# Altium project QUTMS-CC-V00.PrjPcb (part 2 of 2)
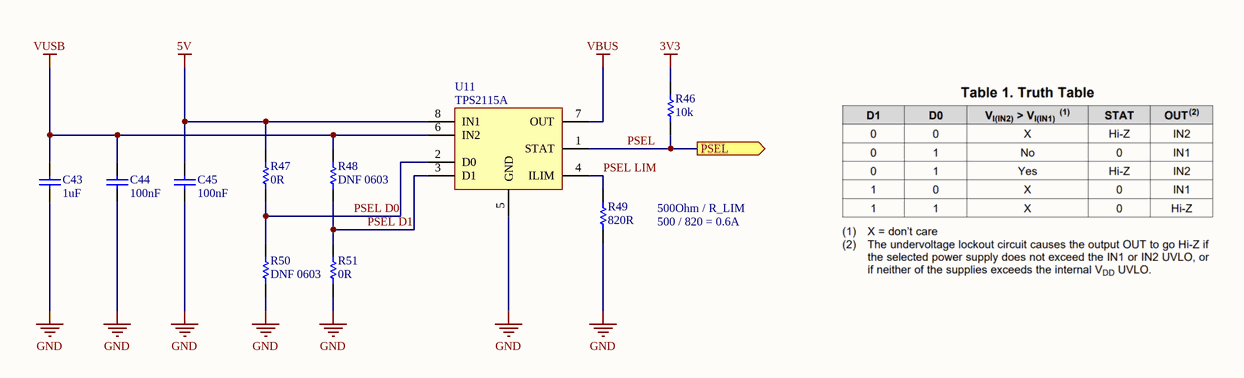
[diagram p13: CC-S12-V00-PowerSwitch.SchDoc]

## Nets that join several sheets
3V3: CANBUS 1 (C25A.2 DS1A.1 DS2A.1 U6A.3), CANBUS 2 (C25B.2 DS1B.1 DS2B.1 U6B.3), CANBUS 3 (C25C.2 DS1C.1 DS2C.1 U6C.3), CC-S08-V00-Connector (J4.B13 J4.B21), CC-S04-V00-SerialComs (C42.1 C51.1 U7.16 U8.1), CC-S01-V00-Microcontroller (23 pins), CC-S05-V00-MicrocontrollerPeripherals (C38.2 C39.2 C40.2 SD1.4), CC-S09-V00-PSU-3V3 (6 pins), CC-S12-V00-PowerSwitch (R46.2)
5V: CC-S08-V00-Connector (J4.B12 J4.B20), CC-S10-V00-PSU-5V (6 pins), CC-S12-V00-PowerSwitch (C45.2 R47.2 U11.8)
AGND: CC-S08-V00-Connector (J4.A5 J4.A20 J4.A21 J4.A22), Analog In1 (C26A.1 D9A.A D10A.A R25A.1), Analog In2 (C26B.1 D9B.A D10B.A R25B.1), Analog In3 (C26C.1 D9C.A D10C.A R25C.1), Analog In4 (C26D.1 D9D.A D10D.A R25D.1), Analog In5 (C26E.1 D9E.A D10E.A R25E.1), Analog In6 (C26F.1 D9F.A D10F.A R25F.1), Analog In7 (C26G.1 D9G.A D10G.A R25G.1), Analog In8 (C26H.1 D9H.A D10H.A R25H.1), Analog In9 (C26I.1 D9I.A D10I.A R25I.1), Analog In10 (C26J.1 D9J.A D10J.A R25J.1), Analog In11 (C26K.1 D9K.A D10K.A R25K.1), Analog In12 (C26L.1 D9L.A D10L.A R25L.1), CC-S11-V00-Power (L4.2 R44.2 R45.2)
GND: CANBUS 1 (C25A.1 D3A.3 U6A.2 U6A.8), CANBUS 2 (C25B.1 D3B.3 U6B.2 U6B.8), CANBUS 3 (C25C.1 D3C.3 U6C.2 U6C.8), CC-S08-V00-Connector (5 pins), CC-S04-V00-SerialComs (12 pins), Digital In1 (C46A.1 D18A.A D19A.A R54A.1), Digital In2 (C46B.1 D18B.A D19B.A R54B.1), Digital In3 (C46C.1 D18C.A D19C.A R54C.1), Digital In4 (C46D.1 D18D.A D19D.A R54D.1), CC-S02-V00-HighSideOutputs (16 pins), CC-S01-V00-Microcontroller (29 pins), CC-S05-V00-MicrocontrollerPeripherals (18 pins), CC-S11-V00-Power (L4.1 R44.1 R45.1), CC-S10-V00-PSU-5V (10 pins), CC-S09-V00-PSU-3V3 (9 pins), CC-S12-V00-PowerSwitch (7 pins)
VBUS: CC-S08-V00-Connector (J4.B4 J4.B29), CC-S04-V00-SerialComs (D17.5), CC-S09-V00-PSU-3V3 (C28.2 C29.2 U9.4 U9.5), CC-S12-V00-PowerSwitch (U11.7)
VCC: CC-S08-V00-Connector (J4.B2 J4.B3 J4.B11), CC-S02-V00-HighSideOutputs (6 pins), CC-S10-V00-PSU-5V (5 pins)
VUSB: CC-S05-V00-MicrocontrollerPeripherals (D16.5 J5.1 R32.2 R35.2), CC-S12-V00-PowerSwitch (C43.2 C44.2 R48.2 U11.6)
AIN1: CC-S08-V00-Connector (J4.A1), Analog In1 (D10A.K R23A.2)
AIN2: CC-S08-V00-Connector (J4.A2), Analog In2 (D10B.K R23B.2)
AIN3: CC-S08-V00-Connector (J4.A3), Analog In3 (D10C.K R23C.2)
AIN4: CC-S08-V00-Connector (J4.A4), Analog In4 (D10D.K R23D.2)
AIN5: CC-S08-V00-Connector (J4.A8), Analog In5 (D10E.K R23E.2)
AIN6: CC-S08-V00-Connector (J4.A9), Analog In6 (D10F.K R23F.2)
AIN7: CC-S08-V00-Connector (J4.A10), Analog In7 (D10G.K R23G.2)
AIN8: CC-S08-V00-Connector (J4.A11), Analog In8 (D10H.K R23H.2)
AIN9: CC-S08-V00-Connector (J4.A14), Analog In9 (D10I.K R23I.2)
AIN10: CC-S08-V00-Connector (J4.A15), Analog In10 (D10J.K R23J.2)
AIN11: CC-S08-V00-Connector (J4.A16), Analog In11 (D10K.K R23K.2)
AIN12: CC-S08-V00-Connector (J4.A17), Analog In12 (D10L.K R23L.2)
AOUT1: Analog In1 (C26A.2 D9A.K R24A.1), CC-S01-V00-Microcontroller (U1.23)
AOUT2: Analog In2 (C26B.2 D9B.K R24B.1), CC-S01-V00-Microcontroller (U1.28)
AOUT3: Analog In3 (C26C.2 D9C.K R24C.1), CC-S01-V00-Microcontroller (U1.30)
AOUT4: Analog In4 (C26D.2 D9D.K R24D.1), CC-S01-V00-Microcontroller (U1.32)
AOUT5: Analog In5 (C26E.2 D9E.K R24E.1), CC-S01-V00-Microcontroller (U1.25)
AOUT6: Analog In6 (C26F.2 D9F.K R24F.1), CC-S01-V00-Microcontroller (U1.29)
AOUT7: Analog In7 (C26G.2 D9G.K R24G.1), CC-S01-V00-Microcontroller (U1.31)
AOUT8: Analog In8 (C26H.2 D9H.K R24H.1), CC-S01-V00-Microcontroller (U1.34)
AOUT9: Analog In9 (C26I.2 D9I.K R24I.1), CC-S01-V00-Microcontroller (U1.24)
AOUT10: Analog In10 (C26J.2 D9J.K R24J.1), CC-S01-V00-Microcontroller (U1.22)
AOUT11: Analog In11 (C26K.2 D9K.K R24K.1), CC-S01-V00-Microcontroller (U1.33)
AOUT12: Analog In12 (C26L.2 D9L.K R24L.1), CC-S01-V00-Microcontroller (U1.35)
CAN1 RX: CANBUS 1 (R19A.1 U6A.4), CC-S01-V00-Microcontroller (U1.70)
CAN1 TX: CANBUS 1 (R18A.1 U6A.1), CC-S01-V00-Microcontroller (U1.71)
CAN2 RX: CANBUS 2 (R19B.1 U6B.4), CC-S01-V00-Microcontroller (U1.51)
CAN2 TX: CANBUS 2 (R18B.1 U6B.1), CC-S01-V00-Microcontroller (U1.92)
CAN3 RX: CANBUS 3 (R19C.1 U6C.4), CC-S01-V00-Microcontroller (U1.67)
CAN3 TX: CANBUS 3 (R18C.1 U6C.1), CC-S01-V00-Microcontroller (U1.77)
CAN H 1: CANBUS 1 (D3A.2 J3A.1 U6A.7), CC-S08-V00-Connector (J4.A7)
CAN H 2: CANBUS 2 (D3B.2 J3B.1 U6B.7), CC-S08-V00-Connector (J4.A13)
CAN H 3: CANBUS 3 (D3C.2 J3C.1 U6C.7), CC-S08-V00-Connector (J4.A19)
CAN L 1: CANBUS 1 (D3A.1 R20A.1 U6A.6), CC-S08-V00-Connector (J4.A6)
CAN L 2: CANBUS 2 (D3B.1 R20B.1 U6B.6), CC-S08-V00-Connector (J4.A12)
CAN L 3: CANBUS 3 (D3C.1 R20C.1 U6C.6), CC-S08-V00-Connector (J4.A18)
DIN1: CC-S08-V00-Connector (J4.B7), Digital In1 (D19A.K R52A.2)
DIN2: CC-S08-V00-Connector (J4.B15), Digital In2 (D19B.K R52B.2)
DIN3: CC-S08-V00-Connector (J4.B23), Digital In3 (D19C.K R52C.2)
DIN4: CC-S08-V00-Connector (J4.B32), Digital In4 (D19D.K R52D.2)
DOUT1: Digital In1 (C46A.2 D18A.K R53A.1), CC-S01-V00-Microcontroller (U1.45)
DOUT2: Digital In2 (C46B.2 D18B.K R53B.1), CC-S01-V00-Microcontroller (U1.44)
DOUT3: Digital In3 (C46C.2 D18C.K R53C.1), CC-S01-V00-Microcontroller (U1.43)
DOUT4: Digital In4 (C46D.2 D18D.K R53D.1), CC-S01-V00-Microcontroller (U1.42)
HSADC1: CC-S02-V00-HighSideOutputs (C17.2 C18.2 R6.1), CC-S01-V00-Microcontroller (U1.18)
HSADC2: CC-S02-V00-HighSideOutputs (C23.2 C24.2 R14.1), CC-S01-V00-Microcontroller (U1.17)
HSDIAG1: CC-S02-V00-HighSideOutputs (R4.1), CC-S01-V00-Microcontroller (U1.39)
HSDIAG2: CC-S02-V00-HighSideOutputs (R5.1), CC-S01-V00-Microcontroller (U1.40)
HSDIAG3: CC-S02-V00-HighSideOutputs (R12.1), CC-S01-V00-Microcontroller (U1.5)
HSDIAG4: CC-S02-V00-HighSideOutputs (R13.1), CC-S01-V00-Microcontroller (U1.36)
HSEN1: CC-S02-V00-HighSideOutputs (R2.1), CC-S01-V00-Microcontroller (U1.41)
HSEN2: CC-S02-V00-HighSideOutputs (R3.1), CC-S01-V00-Microcontroller (U1.38)
HSEN3: CC-S02-V00-HighSideOutputs (R10.1), CC-S01-V00-Microcontroller (U1.37)
HSEN4: CC-S02-V00-HighSideOutputs (R11.1), CC-S01-V00-Microcontroller (U1.7)
HSOUT1: CC-S08-V00-Connector (J4.B1), CC-S02-V00-HighSideOutputs (C14.2 U4.12 U4.13 U4.14)
HSOUT2: CC-S08-V00-Connector (J4.B10), CC-S02-V00-HighSideOutputs (C15.2 U4.8 U4.9 U4.10)
HSOUT3: CC-S08-V00-Connector (J4.B18), CC-S02-V00-HighSideOutputs (C20.2 U5.12 U5.13 U5.14)
HSOUT4: CC-S08-V00-Connector (J4.B26), CC-S02-V00-HighSideOutputs (C21.2 U5.8 U5.9 U5.10)
LED1: CC-S01-V00-Microcontroller (U1.84), CC-S05-V00-MicrocontrollerPeripherals (R39.2)
LED2: CC-S01-V00-Microcontroller (U1.85), CC-S05-V00-MicrocontrollerPeripherals (R40.2)
LED3: CC-S01-V00-Microcontroller (U1.88), CC-S05-V00-MicrocontrollerPeripherals (R41.2)
LED4: CC-S01-V00-Microcontroller (U1.89), CC-S05-V00-MicrocontrollerPeripherals (R43.2)
LED5: CC-S01-V00-Microcontroller (U1.55), CC-S05-V00-MicrocontrollerPeripherals (R55.2)
LED6: CC-S01-V00-Microcontroller (U1.56), CC-S05-V00-MicrocontrollerPeripherals (R56.2)
PSEL: CC-S01-V00-Microcontroller (U1.1), CC-S12-V00-PowerSwitch (R46.1 U11.1)
RS232A RX: CC-S08-V00-Connector (J4.A25), CC-S04-V00-SerialComs (D4.1 U7.14)
RS232A TX: CC-S08-V00-Connector (J4.A26), CC-S04-V00-SerialComs (D4.2 U7.13)
RS232B RX: CC-S08-V00-Connector (J4.A23), CC-S04-V00-SerialComs (D5.2 U7.7)
RS232B TX: CC-S08-V00-Connector (J4.A24), CC-S04-V00-SerialComs (D5.1 U7.8)
RS485 A: CC-S08-V00-Connector (J4.B9), CC-S04-V00-SerialComs (D6.1 J6.2 J7.2 U8.8)
RS485 B: CC-S08-V00-Connector (J4.B17), CC-S04-V00-SerialComs (D6.2 J8.1 R57.1 U8.7)
RS485 Y: CC-S08-V00-Connector (J4.B25), CC-S04-V00-SerialComs (D7.1 J7.1 R58.2 U8.5)
RS485 Z: CC-S08-V00-Connector (J4.B34), CC-S04-V00-SerialComs (D7.2 J8.2 J9.1 U8.6)
SD CLK: CC-S01-V00-Microcontroller (U1.80), CC-S05-V00-MicrocontrollerPeripherals (SD1.5)
SD CMD: CC-S01-V00-Microcontroller (U1.83), CC-S05-V00-MicrocontrollerPeripherals (SD1.3)
SD DATA0: CC-S01-V00-Microcontroller (U1.65), CC-S05-V00-MicrocontrollerPeripherals (SD1.7)
SD DATA1: CC-S01-V00-Microcontroller (U1.66), CC-S05-V00-MicrocontrollerPeripherals (SD1.8)
SD DATA2: CC-S01-V00-Microcontroller (U1.78), CC-S05-V00-MicrocontrollerPeripherals (SD1.1)
SD DATA3: CC-S01-V00-Microcontroller (U1.79), CC-S05-V00-MicrocontrollerPeripherals (SD1.2)
UART1 RX: CC-S04-V00-SerialComs (U7.12), CC-S01-V00-Microcontroller (U1.81)
UART1 TX: CC-S04-V00-SerialComs (U7.11), CC-S01-V00-Microcontroller (U1.82)
UART2 RX: CC-S04-V00-SerialComs (U7.9), CC-S01-V00-Microcontroller (U1.87)
UART2 TX: CC-S04-V00-SerialComs (U7.10), CC-S01-V00-Microcontroller (U1.86)
UART3 RX: CC-S04-V00-SerialComs (U8.2), CC-S01-V00-Microcontroller (U1.69)
UART3 TX: CC-S04-V00-SerialComs (U8.3), CC-S01-V00-Microcontroller (U1.68)
UART4 RX: CC-S04-V00-SerialComs (R22.1), CC-S01-V00-Microcontroller (U1.47)
UART4 TX: CC-S04-V00-SerialComs (R21.1), CC-S01-V00-Microcontroller (U1.46)
UARTP RX: CC-S08-V00-Connector (J4.B16), CC-S04-V00-SerialComs (D8.2 D17.4)
UARTP TX: CC-S08-V00-Connector (J4.B8), CC-S04-V00-SerialComs (D8.1 D17.6)
USB DET: CC-S01-V00-Microcontroller (U1.52), CC-S05-V00-MicrocontrollerPeripherals (R32.1 R33.1)
USB_N: CC-S01-V00-Microcontroller (U1.53), CC-S05-V00-MicrocontrollerPeripherals (R34.1)
USB_P: CC-S01-V00-Microcontroller (U1.54), CC-S05-V00-MicrocontrollerPeripherals (R36.1)